# EAGLE design Power_12V-0.5A (EAGLE 7.1.0)
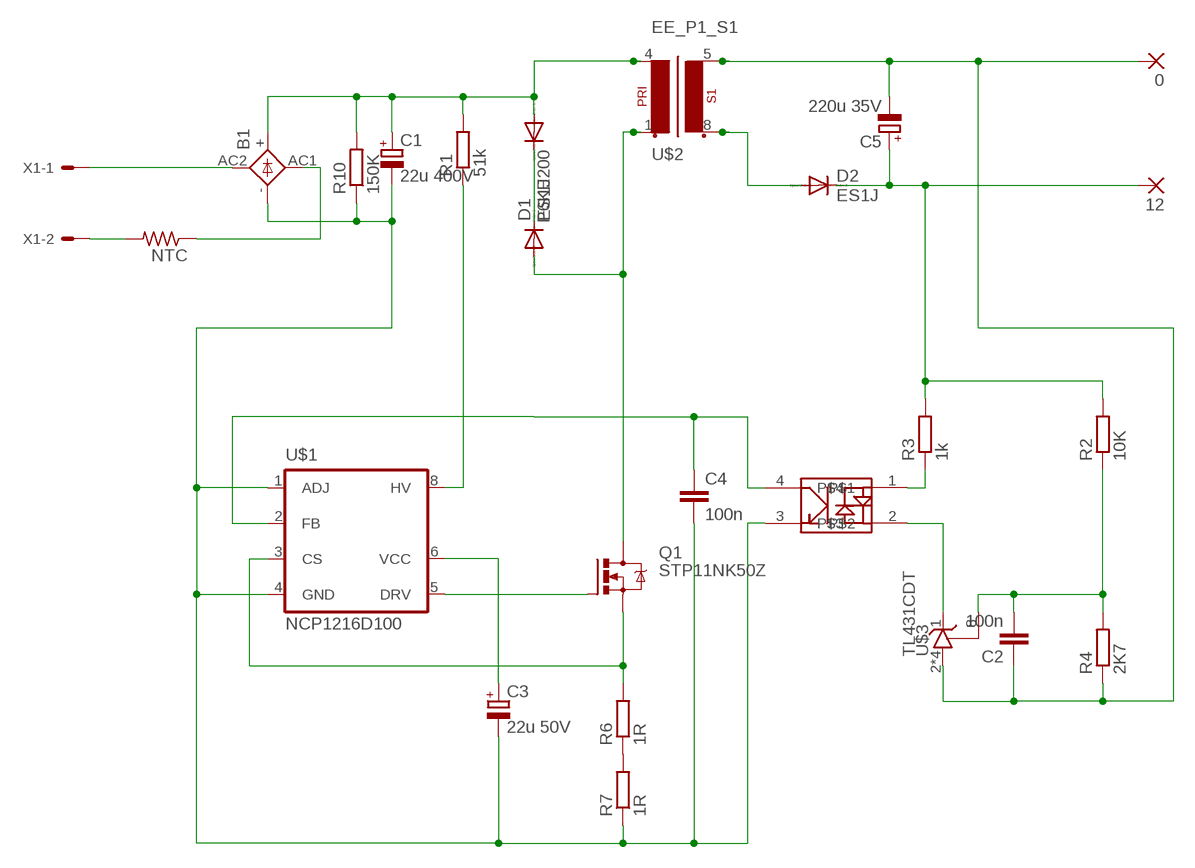
[diagram p0: schematic, sheet 1]

## Parts
0  2,54/0,8  [2,54/0,8]
12  2,54/0,8  [2,54/0,8]
B1  KBL  [KBL]
C1  22u 400V  CPOL-EUE5-13  [E5-13]
C2  100n  C-EUC1206  [C1206]
C3  22u 50V  CPOL-EUE2.5-5  [E2,5-5]
C4  100n  C-EUC1206  [C1206]
C5  220u 35V  CPOL-EUE2.5-7  [E2,5-7]
D1  ES1J  DIODE-DO-214AC  [DO-214AC]
D2  ES1J  DIODE-DO-214AC  [DO-214AC]
NTC  R-US_0207/10  [0207/10]
P6KE200  DIODE-SMB  [SMB]
Q1  STP11NK50Z  IRF740  [TO220BV]
R1  51k  R-EU_0922/22  [0922/22]
R2  10K  R-EU_R1206  [R1206]
R3  1k  R-EU_R1206  [R1206]
R4  2K7  R-EU_R1206  [R1206]
R6  1R  R-EU_R1206  [R1206]
R7  1R  R-EU_R1206  [R1206]
R10  150K  R-EU_0204/7  [0204/7]
U$1  NCP1216D100  NCP1200-100SO  [SOP8]
U$2  EE_P1_S1  [EE25_P1_S1]
U$3  TL431CDT  [SO8]
U$5  EL3H4(TA)-VG  [SSOP4]
X1  KK-156-2  [KK-156-2]

## Nets
N$1: NTC.2 X1.2
N$2: B1.AC2(AC1) X1.1
N$3: B1.AC1(AC2) NTC.1
N$4: R6.1 R7.2
N$5: C4.1 U$1.2(FB) U$5.4
N$6: B1.+ C1.+ P6KE200.A R1.2 R10.2 U$2.4(P1-2)
N$7: D1.C P6KE200.C
N$8: D1.A Q1.D U$2.1(P1-1)
N$9: C2.2 R2.1 R4.2 U$3.8(R)
N$10: R1.1 U$1.8(HV)
N$11: Q1.G U$1.5(DRV)
N$12: Q1.S R6.2 U$1.3(CS)
N$13: R3.1 U$5.1
N$14: C3.+ U$1.6(VCC)
N$15: U$3.1(C) U$5.2
N$16: B1.- C1.- C3.- C4.2 R7.1 R10.1 U$1.1(ADJ) U$1.4(GND) U$5.3
N$17: 0.1(P) C2.1 C5.- R4.1 U$2.5(S1-2) U$3.2(A) U$3.3(A) U$3.6(A) U$3.7(A)
N$19: 12.1(P) C5.+ D2.C R2.2 R3.2
N$21: D2.A U$2.8(S1-1)

## Library data of the parts
0 12 = wirepad:2,54/0,8: THROUGH-HOLE PAD
B1 = rectifier:KBL: DIOTEC RECTIFIER
C1 C3 C5 = rcl:CPOL-EU: POLARIZED CAPACITOR, European symbol
C2 C4 = rcl:C-EU: CAPACITOR, European symbol
D1 D2 P6KE200 = diode:DIODE-: DIODE
NTC = rcl:R-US_: RESISTOR, American symbol
Q1 = transistor-power:IRF740: N-CHANNEL MOS FET
R1-R4 R6 R7 R10 = rcl:R-EU_: RESISTOR, European symbol
U$1 = NCP1200:NCP1200-100
U$2 = _Transformers:EE_P1_S1
U$3 = Namenlos:TL431
U$5 = Namenlos:EL3H4(TA)-VG
X1 = con-molex:KK-156-2: KK 156 HEADER Source: http://www.molex.com/pdm_docs/sd/026604100_sd.pdf; OC_FARNELL: unknown; OC_NEWARK: unknown

## Board
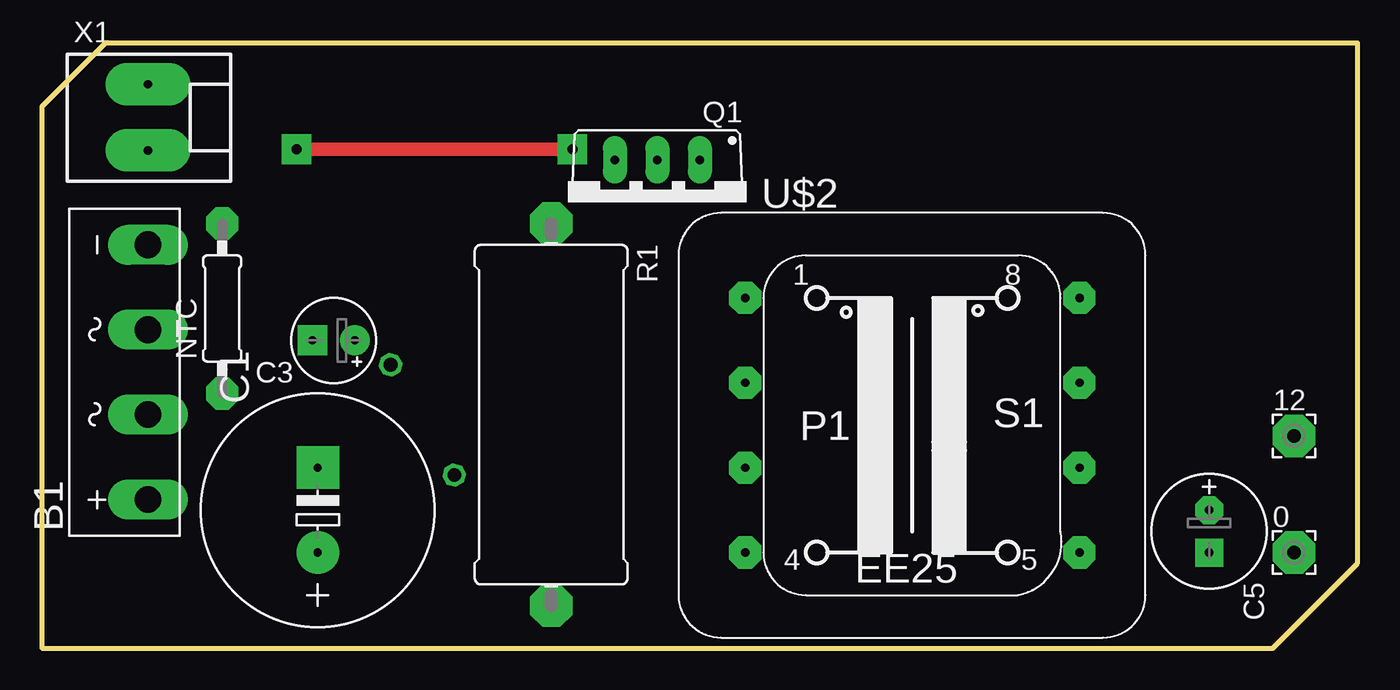
[diagram p1: board, top side]
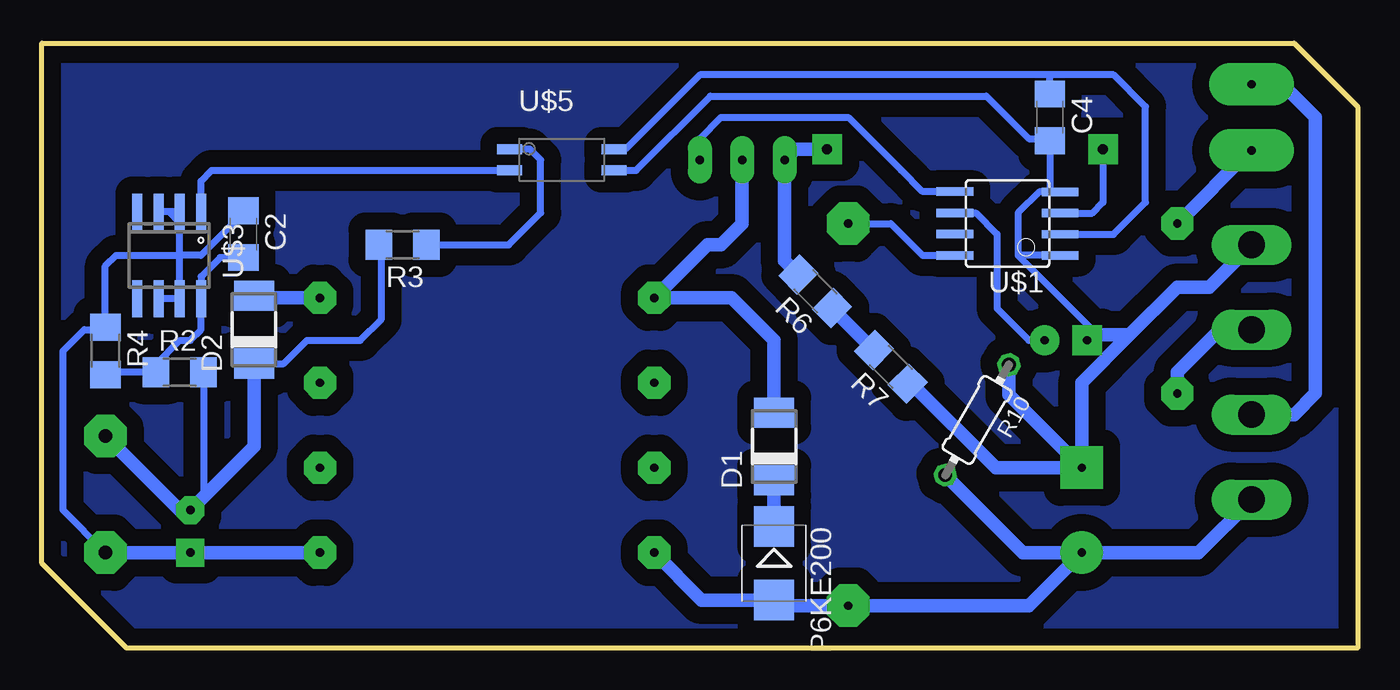
[diagram p2: board, bottom side, seen from below]

Size 78.74 x 36.2 mm. Coordinates in mm from the lower left corner, seen from the top.
Outline: 78.74,36.2 3.81,36.2 0,32.38 0,0 73.66,0 78.74,5.08 78.74,36.2
Copper layers (1*16): Top 0.035mm / dielectric 1.5mm / Bottom 0.035mm
Design rules "default": minimum track width 10mil, minimum drill 24mil, track to track 8mil, track to pad 8mil, pad to pad 8mil, via to via 8mil, smd to smd 8mil, copper to edge 40mil, drill to drill 8mil, minimum pad ring 10mil, minimum via ring 8mil, stop-mask expansion 4mil, vias tented up to drill 0mil, thermal gap 10mil

### Footprints (pad centres in the part's own frame; a part is rotated, then mirrored left to right if it is on the bottom)
2,54/0,8 = drill 0.813 pad 2.54 octagon: 1 0,0
KBL = drill 1.6 long: + -7.62,-1.27; - 7.62,-1.27; AC1 2.54,-1.27; AC2 -2.54,-1.27
E5-13 = drill 0.5 pad 2.54: + -2.54,0 | drill 0.5 pad 2.54 square: - 2.54,0
C1206 = smd 1.6 x 1.8: 1 -1.4,0; 2 1.4,0
E2,5-5 = drill 0.5 pad 1.778: + -1.27,0 | drill 0.5 pad 1.778 square: - 1.27,0
E2,5-7 = drill 0.5 pad 1.676 octagon: + -1.27,0 | drill 0.5 pad 1.676 square: - 1.27,0
DO-214AC = smd 1.8 x 2.4: A 2.025,0; C -2.025,0
0207/10 = drill 0.5 pad 1.93 octagon: 1 -5.08,0; 2 5.08,0
SMB = smd 2.4 x 2.4: A 2.2,0; C -2.2,0
TO220BV = drill 0.5 pad 1.422 long: D 0,-2.54; G -2.54,-2.54; S 2.54,-2.54
0922/22 = drill 0.5 pad 2.54 octagon: 1 -11.43,0; 2 11.43,0
R1206 = smd 1.6 x 1.803: 1 -1.422,0; 2 1.422,0
0204/7 = drill 0.813 octagon: 1 -3.81,0; 2 3.81,0
SOP8 = smd 0.5 x 2.2: 1 -1.905,-3.154; 2 -0.645,-3.154; 3 0.625,-3.154; 4 1.895,-3.154; 5 1.905,3.154; 6 0.635,3.154; 7 -0.635,3.154; 8 -1.905,3.154
EE25_P1_S1 = drill 0.5 pad 1.93 octagon: 1 -9.98,7.62; 2 -9.98,2.54; 3 -9.98,-2.54; 4 -9.98,-7.62; 5 10.02,-7.62; 6 10.02,-2.54; 7 10.02,2.54; 8 10.02,7.62
SO8 = smd 0.6 x 2.2: 1 -1.905,-2.6; 2 -0.635,-2.6; 3 0.635,-2.6; 4 1.905,-2.6; 5 1.905,2.6; 6 0.635,2.6; 7 -0.635,2.6; 8 -1.905,2.6
SSOP4 = smd 0.6 x 1.5: 1 -0.635,-3.115; 2 0.635,-3.115; 3 0.635,3.115; 4 -0.635,3.115
KK-156-2 = drill 0.5 pad 2.54 long: 1 -1.98,0; 2 1.98,0

### Placement (x,y rotation side)
0  74.93,5.71 0 top
12  74.93,12.7 0 top
B1  5.08,16.51 90 top
C1  16.51,8.26 90 top
C2  66.67,24.76 270 bottom
C3  17.46,18.41 180 top
C4  18.42,31.75 270 bottom
C5  69.85,6.98 270 top
D1  34.92,12.06 90 bottom
D2  66.04,19.05 90 bottom
NTC  10.79,20.32 90 top
P6KE200  34.92,5.08 270 bottom
Q1  36.83,26.67 180 top
R1  30.48,13.97 270 top
R2  70.48,16.51 0 bottom
R3  57.15,24.13 180 bottom
R4  74.93,17.78 270 bottom
R6  32.46,21.35 135 bottom
R7  27.94,16.83 135 bottom
R10  22.77,13.65 240 bottom
U$1  20.96,25.4 90 bottom
U$2  52.07,13.34 0 top
U$3  71.12,23.49 180 bottom
U$5  47.62,29.21 270 bottom
X1  6.35,31.75 270 top

### Tracks (layer width: path | path; a pad name or v marks a point on that pad's centre or on a via)
N$1
  Bottom 0.813: X1.2 6.43,29.77 NTC.2
N$2
  Bottom 0.813: X1.1 4.52,33.73 2.54,31.75 2.54,15.24 3.81,13.97 B1.AC2
N$3
  Bottom 0.813: NTC.1 10.79,16.51 8.25,19.05 B1.AC1
N$4
  Bottom 0.813: R7.2 R6.1
N$5
  Bottom 0.406: U$1.2 14.61,24.76 12.7,26.67 12.7,32.38 14.61,34.29 18.42,34.29 | 18.42,34.29 39.37,34.29 43.81,29.84 U$5.4 | C4.1 18.42,34.29
N$6
  Bottom 0.813: B1.+ 9.52,5.71 C1.+ | C1.+ 19.68,2.54 R1.2 34.58,2.54 P6KE200.A 39.25,2.88 U$2.4 | R10.2 20.04,5.71 C1.+
N$7
  Bottom 0.813: P6KE200.C D1.C
N$8
  Bottom 0.813: D1.A 34.92,18.41 37.47,20.95 U$2.1 38.92,24.13 38.1,24.13 36.83,25.4 Q1.D
N$9
  Bottom 0.406: C2.2 68.08,23.37 69.22,22.23 U$3.8 69.22,19.05 69.85,18.41 70.48,18.41 71.91,16.99 R2.1 74.78,16.51 R4.2
N$10
  Bottom 0.406: R1.1 27.94,25.4 26.04,23.49 U$1.8
N$11
  Bottom 0.406: U$1.5 26.04,27.3 27.3,28.57 30.48,31.75 38.1,31.75 39.37,30.48 Q1.G
N$12  (via drill 0.6 pad 1.78)
  Top 0.813: v31.75,29.84 v15.24,29.84
  Bottom 0.406: U$1.3 15.89,26.02 15.24,26.67 v15.24,29.84
  Bottom 0.813: v31.75,29.84 33.66,29.84 Q1.S 34.29,23.18 R6.2
N$13
  Bottom 0.406: R3.1 50.8,24.13 48.89,26.04 48.89,29.21 49.53,29.84 U$5.1
N$14
  Bottom 0.406: C3.+ 19.68,18.41 21.59,20.32 21.59,24.76 22.86,26.04 U$1.6
N$15
  Bottom 0.406: U$3.1 69.22,27.94 68.58,28.57 U$5.2
N$16
  Bottom 0.406: U$1.4 18.42,27.29 | 18.42,27.29 19.06,27.29 20.32,26.04 20.32,23.49 | 20.32,23.49 15.87,19.05 15.87,18.73 | U$1.1 20.32,23.49 | 18.42,27.29 C4.2 18.54,30.48 19.68,30.48 22.22,33.02 38.73,33.02 43.18,28.57 U$5.3
  Bottom 0.813: B1.- 8.89,21.59 10.79,21.59 13.65,18.73 | 13.65,18.73 16.51,15.87 C1.- | C3.- 15.87,18.73 13.65,18.73 | R10.1 20.87,15.15 C1.- | R7.1 26.69,15.82 21.67,10.79 C1.-
N$17
  Bottom 0.406: U$3.2 71.12,26.09 | 71.12,26.09 U$3.3 | U$3.6 U$3.7 70.48,23.49 | 70.48,23.49 70.48,25.46 71.12,26.09 | C2.1 66.67,26.04 69.22,23.49 70.48,23.49 | 0.1 77.47,8.26 77.47,10.79 77.47,17.78 76.2,19.05 75.08,19.05 R4.1 74.93,22.86 74.3,23.49 70.48,23.49
  Bottom 0.813: U$2.5 C5.- 0.1
N$18
  pour Bottom (isolate 1.016): 0,32.38 3.81,36.2 78.74,36.2 78.74,5.08 73.66,0 0,0
N$19
  Bottom 0.406: D2.C 64.26,17.02 62.87,18.41 59.69,18.41 58.42,19.68 58.42,23.98 R3.2 | R2.2 69.06,9.04 C5.+
  Bottom 0.813: D2.C 66.04,12.06 C5.+ 70.48,8.26 12.1
N$21
  Bottom 0.813: U$2.8 65.92,20.95 D2.A